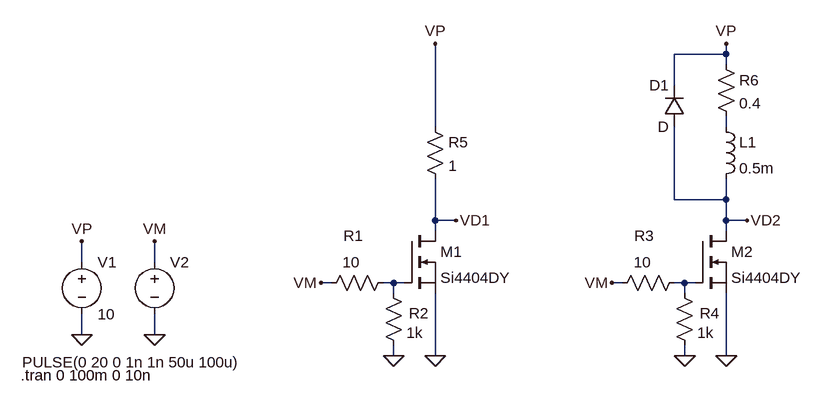
[diagram p0: schematic Loss_01.asc]
Loss_01.asc, the LTspice schematic file:
Version 4
SHEET 1 880 680
WIRE 560 -192 560 -208
WIRE 560 -192 480 -192
WIRE 560 -176 560 -192
WIRE 480 -144 480 -192
WIRE 112 -80 112 -208
WIRE 560 -80 560 -96
WIRE 480 32 480 -80
WIRE 560 32 560 0
WIRE 560 32 480 32
WIRE 112 64 112 0
WIRE 144 64 112 64
WIRE 560 64 560 32
WIRE 592 64 560 64
WIRE 112 80 112 64
WIRE 560 80 560 64
WIRE -432 128 -432 96
WIRE -320 128 -320 96
WIRE -48 160 -64 160
WIRE 48 160 32 160
WIRE 64 160 48 160
WIRE 400 160 384 160
WIRE 496 160 480 160
WIRE 512 160 496 160
WIRE 48 176 48 160
WIRE 496 176 496 160
WIRE -432 240 -432 208
WIRE -320 240 -320 208
WIRE 48 272 48 256
WIRE 112 272 112 176
WIRE 496 272 496 256
WIRE 560 272 560 176
FLAG -432 96 VP
FLAG -432 240 0
FLAG -320 96 VM
FLAG -320 240 0
FLAG 48 272 0
FLAG 112 272 0
FLAG -64 160 VM
FLAG 496 272 0
FLAG 560 272 0
FLAG 384 160 VM
FLAG 560 -208 VP
FLAG 112 -208 VP
FLAG 144 64 VD1
FLAG 592 64 VD2
SYMBOL voltage -432 112 R0
WINDOW 123 0 0 Left 0
WINDOW 39 0 0 Left 0
SYMATTR InstName V1
SYMATTR Value 10
SYMBOL voltage -320 112 R0
WINDOW 3 -204 170 Left 2
WINDOW 123 0 0 Left 0
WINDOW 39 0 0 Left 0
SYMATTR InstName V2
SYMATTR Value PULSE(0 20 0 1n 1n 50u 100u)
SYMBOL nmos 64 80 R0
SYMATTR InstName M1
SYMATTR Value Si4404DY
SYMBOL res 48 144 R90
WINDOW 0 -41 62 VBottom 2
WINDOW 3 -31 65 VTop 2
SYMATTR InstName R1
SYMATTR Value 10
SYMBOL res 64 272 R180
WINDOW 0 -38 65 Left 2
WINDOW 3 -29 35 Left 2
SYMATTR InstName R2
SYMATTR Value 1k
SYMBOL nmos 512 80 R0
SYMATTR InstName M2
SYMATTR Value Si4404DY
SYMBOL res 496 144 R90
WINDOW 0 -41 62 VBottom 2
WINDOW 3 -31 65 VTop 2
SYMATTR InstName R3
SYMATTR Value 10
SYMBOL res 512 272 R180
WINDOW 0 -38 65 Left 2
WINDOW 3 -29 35 Left 2
SYMATTR InstName R4
SYMATTR Value 1k
SYMBOL res 96 -96 R0
SYMATTR InstName R5
SYMATTR Value 1
SYMBOL res 544 -192 R0
SYMATTR InstName R6
SYMATTR Value 0.4
SYMBOL ind 544 -96 R0
SYMATTR InstName L1
SYMATTR Value 0.5m
SYMBOL diode 496 -80 R180
WINDOW 0 24 64 Left 2
WINDOW 3 24 0 Left 2
SYMATTR InstName D1
TEXT -526 302 Left 2 !.tran 0 100m 0 10n

The netlist it stands for:
* Loss_01.asc
V1 VP 0 10
V2 VM 0 PULSE(0 20 0 1n 1n 50u 100u)
M1 VD1 N002 0 0 Si4404DY
R1 N002 VM 10
R2 0 N002 1k
M2 VD2 N003 0 0 Si4404DY
R3 N003 VM 10
R4 0 N003 1k
R5 VP VD1 1
R6 VP N001 0.4
L1 N001 VD2 0.5m
D1 VD2 VP D
.model D D
.lib standard.dio
.model NMOS NMOS
.model PMOS PMOS
.lib standard.mos
.tran 0 100m 0 10n
.backanno
.end